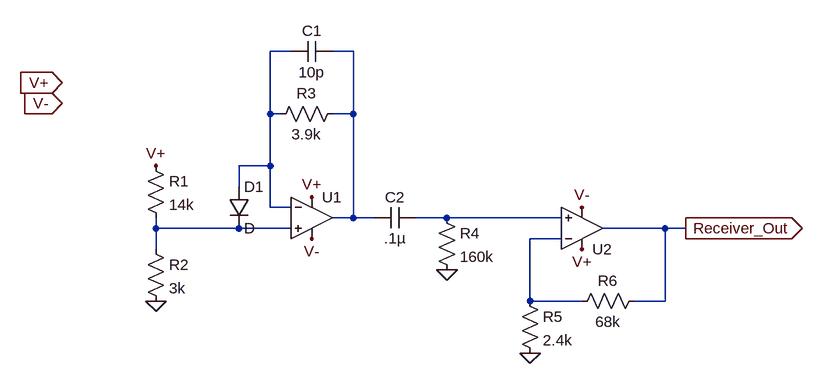
[diagram p0: schematic OpticalReceiver.asc]
OpticalReceiver.asc, the LTspice schematic file:
Version 4
SHEET 1 880 680
WIRE -64 -224 -96 -224
WIRE 32 -224 0 -224
WIRE -96 -128 -96 -224
WIRE -80 -128 -96 -128
WIRE 32 -128 32 -224
WIRE 32 -128 0 -128
WIRE -96 -48 -96 -128
WIRE -96 -48 -144 -48
WIRE -144 -16 -144 -48
WIRE -96 16 -96 -48
WIRE -64 16 -96 16
WIRE 32 32 32 -128
WIRE 32 32 0 32
WIRE 64 32 32 32
WIRE 176 32 128 32
WIRE 352 32 176 32
WIRE -272 48 -272 32
WIRE -144 48 -272 48
WIRE -64 48 -144 48
WIRE 512 48 416 48
WIRE 544 48 512 48
WIRE 352 64 304 64
WIRE -272 80 -272 48
WIRE 304 160 304 64
WIRE 384 160 304 160
WIRE 512 160 512 48
WIRE 512 160 464 160
FLAG -272 160 0
FLAG 176 112 0
FLAG 304 240 0
FLAG -416 -176 V+
IOPIN -416 -176 In
FLAG -416 -144 V-
IOPIN -416 -144 In
FLAG -272 -48 V+
FLAG -32 0 V+
FLAG 384 80 V+
FLAG -32 64 V-
FLAG 384 16 V-
FLAG 544 48 Receiver_Out
IOPIN 544 48 Out
SYMBOL Opamps\\UniversalOpamp2 -32 32 R0
SYMATTR InstName U1
SYMBOL diode -160 -16 R0
SYMATTR InstName D1
SYMBOL res -288 -64 R0
SYMATTR InstName R1
SYMATTR Value 14k
SYMBOL res -288 64 R0
SYMATTR InstName R2
SYMATTR Value 3k
SYMBOL res 16 -144 R90
WINDOW 0 0 56 VBottom 2
WINDOW 3 32 56 VTop 2
SYMATTR InstName R3
SYMATTR Value 3.9k
SYMBOL cap 0 -240 R90
WINDOW 0 0 32 VBottom 2
WINDOW 3 32 32 VTop 2
SYMATTR InstName C1
SYMATTR Value 10p
SYMBOL cap 128 16 R90
WINDOW 0 0 32 VBottom 2
WINDOW 3 32 32 VTop 2
SYMATTR InstName C2
SYMATTR Value .1µ
SYMBOL res 160 16 R0
SYMATTR InstName R4
SYMATTR Value 160k
SYMBOL Opamps\\UniversalOpamp2 384 48 M180
SYMATTR InstName U2
SYMBOL res 288 144 R0
SYMATTR InstName R5
SYMATTR Value 2.4k
SYMBOL res 480 144 R90
WINDOW 0 0 56 VBottom 2
WINDOW 3 32 56 VTop 2
SYMATTR InstName R6
SYMATTR Value 68k

The netlist it stands for:
* OpticalReceiver.asc
XU1 N004 N001 V+ V- N002 level.2 Avol=1Meg GBW=10Meg Slew=10Meg ilimit=25m rail=0 Vos=0 phimargin=45 en=0 enk=0 in=0 ink=0 Rin=500Meg  ; pins IN+ IN- V+ V- OUT
D1 N001 N004 D
R1 V+ N004 14k
R2 N004 0 3k
R3 N002 N001 3.9k
C1 N002 N001 10p
C2 N003 N002 .1µ
R4 N003 0 160k
XU2 N003 N005 V+ V- Receiver_Out level.2 Avol=1Meg GBW=10Meg Slew=10Meg ilimit=25m rail=0 Vos=0 phimargin=45 en=0 enk=0 in=0 ink=0 Rin=500Meg  ; pins IN+ IN- V+ V- OUT
R5 N005 0 2.4k
R6 Receiver_Out N005 68k
.model D D
.lib standard.dio
.lib UniversalOpamps2.sub
.backanno
.end